# Altium schematic sheet BSPDInputs.SchDoc
size A4
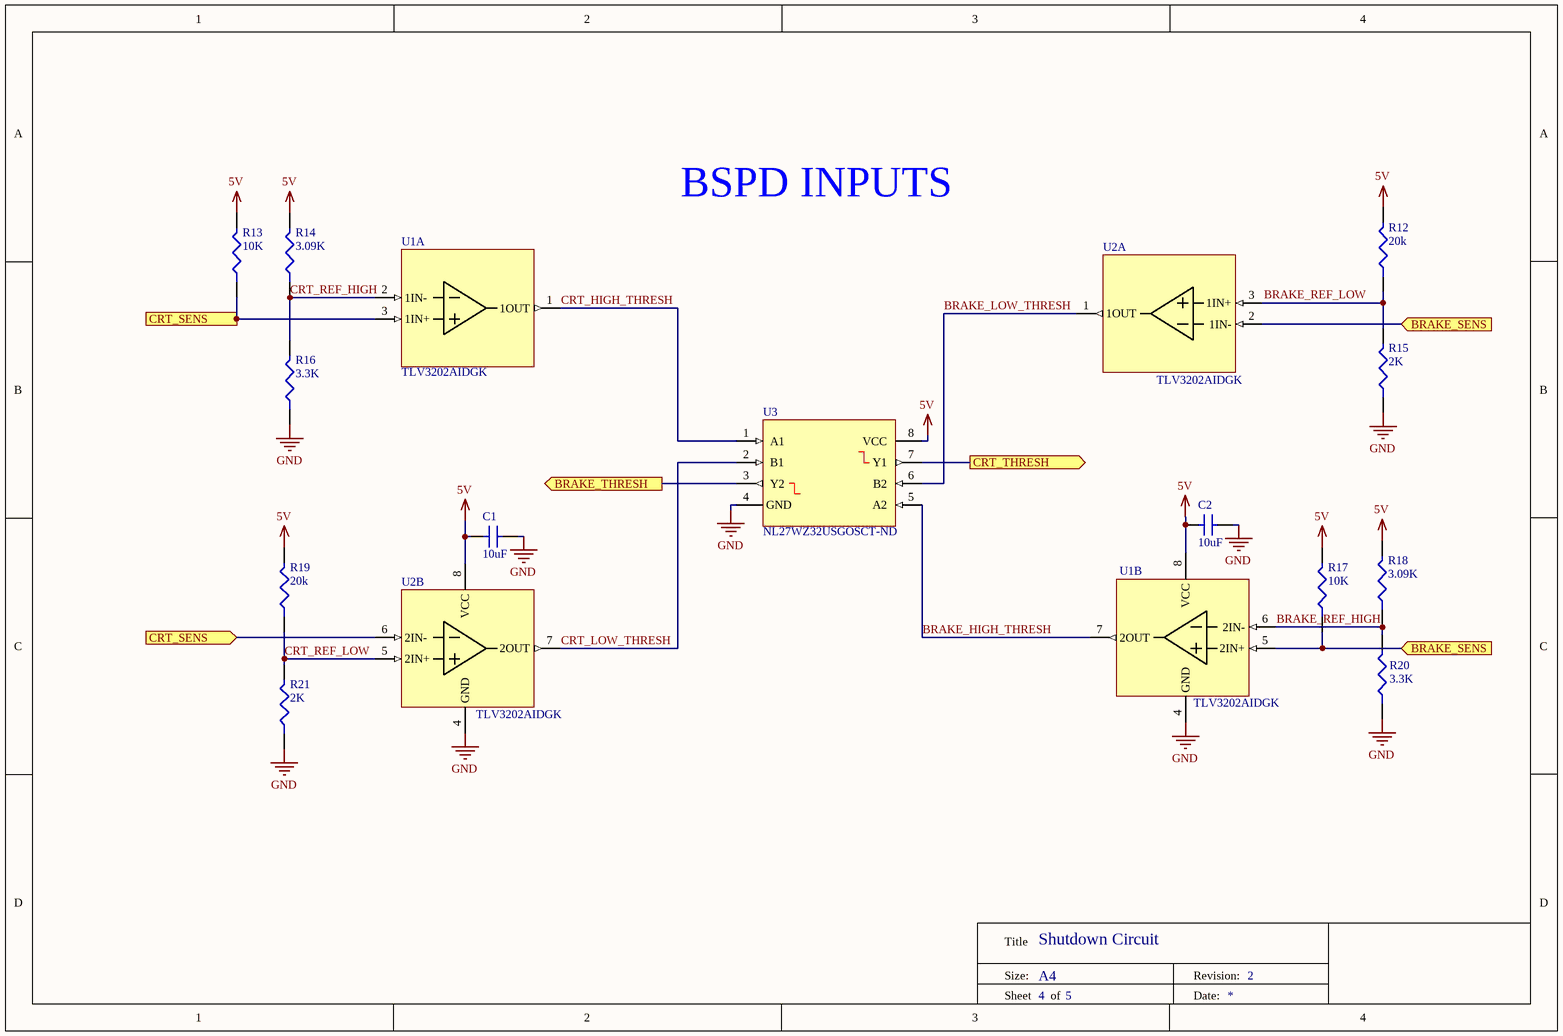
[diagram p0: BSPDInputs.SchDoc]

## Parts
C1  10uF  [C0805]
C2  10uF  [C0805]
R12  20k  [RESC1608X06N]
R13  10K  [R0805]
R14  3.09K  [ERJPB3]
R15  2K  [R0805]
R16  3.3K  [ERJPB3]
R17  10K  [R0805]
R18  3.09K  [ERJPB3]
R19  20k  [RESC1608X06N]
R20  3.3K  [ERJPB3]
R21  2K  [R0805]
U1  TLV3202AIDGK  [TLV3202AIDGK]  (parts A,B of 2)
U2  TLV3202AIDGK  [TLV3202AIDGK]  (parts A,B of 2)
U3  NL27WZ32USGOSCT-ND  [TSSOP50P310X90-8N]

## Ports
BRAKE_SENS (in), BRAKE_THRESH (out), CRT_SENS (in), CRT_THRESH (out)

## Nets
5V: C1.2 C2.2 R12.2 R13.2 R14.2 R17.2 R18.2 R19.2 U1.8(VCC) U2.8(VCC) U3.8(VCC)
GND: C1.1 C2.1 R15.1 R16.1 R20.1 R21.1 U1.4(GND) U2.4(GND) U3.4(GND)
BRAKE_HIGH_THRESH: U1.7(2OUT) U3.5(A2)
BRAKE_LOW_THRESH: U2.1(1OUT) U3.6(B2)
BRAKE_REF_HIGH: R18.1 R20.2 U1.6(2IN-)
BRAKE_REF_LOW: R12.1 R15.2 U2.3(1IN+)
BRAKE_SENS: R17.1 U1.5(2IN+) U2.2(1IN-) ; port BRAKE_SENS
BRAKE_THRESH: U3.3(Y2) ; port BRAKE_THRESH
CRT_HIGH_THRESH: U1.1(1OUT) U3.1(A1)
CRT_LOW_THRESH: U2.7(2OUT) U3.2(B1)
CRT_REF_HIGH: R14.1 R16.2 U1.2(1IN-)
CRT_REF_LOW: R19.1 R21.2 U2.5(2IN+)
CRT_SENS: R13.1 U1.3(1IN+) U2.6(2IN-) ; port CRT_SENS
CRT_THRESH: U3.7(Y1) ; port CRT_THRESH

## Notes on the sheet
- BSPD INPUTS
- Shutdown Circuit
- 2
- 4
- 5
- Title
- Size:
- A4
- Revision:
- Sheet
- of
- Date:

## Library data of the parts
C1 C2 = CL21A106KPFNNNG: Cap Ceramic 10uF 10V X5R 10% SMD 0805 85C Embossed T/R; Manufacturer: Samsung; Supplier 1: Digi-Key; Manufacturer Part Number: CL21A106KPFNNNG; Stock 1: 0; Pricing 1: 1=0.15, 10=0.104, 100=0.0489, 500=0.03428, 1000=0.02837 (USD); Mount: Surface Mount; Case/Package: 0805; Case Code (Metric): 2012; Case Code (Imperial): 0805; Min Operating Temperature: -55°C; Max Operating Temperature: 85°C; Capacitance: 10uF; Tolerance: 10%; Dielectric: X5R; Voltage: 10V; Voltage Rating: 10V; Packaging: Tape and Reel; Package Quantity: 3000; Termination: Wraparound; Length: 2mm; Height: 1.25mm; Depth: 1.25mm; Width: 0.049inch; Thickness: 0.053inch; Radiation Hardening: No; Lead Free: Lead Free; ComponentLink1URL: http://www1.futureelectronics.com/doc/SAMSUNG/CL21A106KPFNNNG.pdf?src-supplier=Future+Electronics; ComponentLink1Description: http://www1.futureelectronics.com/doc/SAMSUNG/CL21A106KPFNNNG.pdf?src-supplier=Future+Electronics; ComponentLink2URL: https://www.verical.com/server-webapp/html/getDatasheet?partID=640497&src-supplier=Verical; ComponentLink2Description: https://www.verical.com/server-webapp/html/getDatasheet?partID=640497&src-supplier=Verical; Supplier Part Number 1: 1276-6456-1-ND
R12 R19 = RC0603FR-0722KL: YAGEO - RC0603FR-0722KL - SMD Chip Resistor, 0603 [1608 Metric], 22 kohm, RC Series, 75 V, Thick Film, 100 mW; Temperature Coefficient: 100ppm/°C; Tolerance: 1%; Power Rating: 100mW; Resistance: 22kR; Voltage Rating (DC): 50V; Supplier 1: Digi-Key; Manufacturer: Yageo; Manufacturer Part Number: RC0603FR-0722KL; Stock 1: 4730667; Pricing 1: 1=0.10000, 10=0.02300, 100=0.00940, 1000=0.00421, 2500=0.00366 (USD); RoHS: Yes; Case/Package: 0603; Number of Pins: 2; Case Code (Imperial): 0603; Case Code (Metric): 1608; Min Operating Temperature: -55°C; Max Operating Temperature: 155°C; Packaging: Tape and Reel; Features: Moisture Resistant; Termination: SMD/SMT; Composition: Thick Film; Number of Terminations: 2; Max Power Dissipation: 100mW; Voltage Rating: 50V; Package Quantity: 1; Military Standard: Not; Length: 1.6mm; Height: 0.022inch; Depth: 0.8mm; Width: 0.031inch; Lead Free: Lead Free; REACH SVHC: No SVHC; ComponentLink1URL: https://datasheet.ciiva.com/2454/pyu-r-int-thick-7-2454424.pdf?src-supplier=Digi-Key; ComponentLink1Description: https://datasheet.ciiva.com/2454/pyu-r-int-thick-7-2454424.pdf?src-supplier=Digi-Key; ComponentLink2URL: https://datasheet.ciiva.com/2454/pyu-r-int-thick-7-2454425.pdf?src-supplier=Digi-Key; ComponentLink2Description: https://datasheet.ciiva.com/2454/pyu-r-int-thick-7-2454425.pdf?src-supplier=Digi-Key; ComponentLink3URL: https://datasheet.ciiva.com/15189/getdatasheetpartid-413247-15189661.pdf?src-supplier=Verical; ComponentLink3Description: https://datasheet.ciiva.com/15189/getdatasheetpartid-413247-15189661.pdf?src-supplier=Verical; ComponentLink4URL: https://datasheet.ciiva.com/7746/1686128-7746302.pdf?src-supplier=Element14; ComponentLink4Description: https://datasheet.ciiva.com/7746/1686128-7746302.pdf?src-supplier=Element14; ComponentLink5URL: https://datasheet.ciiva.com/46412/443971-46412846.pdf?src-supplier=Element14; ComponentLink5Description: https://datasheet.ciiva.com/46412/443971-46412846.pdf?src-supplier=Element14; ComponentLink6URL: https://datasheet.ciiva.com/7746/443971-7746303.pdf?src-supplier=Element14; ComponentLink6Description: https://datasheet.ciiva.com/7746/443971-7746303.pdf?src-supplier=Element14; ComponentLink7URL: https://datasheet.ciiva.com/2454/pyu-r-int-thick-7-2454423.pdf?src-supplier=Digi-Key; ComponentLink7Description: https://datasheet.ciiva.com/2454/pyu-r-int-thick-7-2454423.pdf?src-supplier=Digi-Key; Supplier Part Number 1: 311-22.0KHRCT-ND
R13 R17 = ERA6AEB103V: RES SMD 10K OHM 0.1% 1/8W 0805; Manufacturer: Panasonic; Voltage Rating: 100V; Resistance: 10kR; Power Rating: 125mW; Temperature Coefficient: 25ppm/°C; Supplier 1: Digi-Key; Manufacturer Part Number: ERA6AEB103V; Stock 1: 677238; Pricing 1: 1=0.36, 10=0.302, 100=0.1182, 1000=0.04948, 2500=0.04536 (USD); Mount: Surface Mount; Case/Package: 0805; Number of Pins: 2; Case Code (Metric): 2012; Case Code (Imperial): 0805; Contact Plating: Tin; Min Operating Temperature: -55°C; Max Operating Temperature: 155°C; Packaging: Tape and Reel; Tolerance: 0.1%; Package Quantity: 5000; Composition: Metal Film,Thin Film; Number of Terminations: 2; Termination: SMD/SMT; Military Standard: Not; Max Power Dissipation: 125mW; Working Voltage: 100V; Voltage Rating (DC): 100V; Length: 2mm; Height: 0.5mm; Width: 1.25mm; Depth: 1.25mm; Radiation Hardening: No; REACH SVHC: No SVHC; Lead Free: Lead Free; ComponentLink1URL: http://uk.rs-online.com/webdocs/0bee/0900766b80beefcc.pdf?src-supplier=RSComponents; ComponentLink1Description: http://uk.rs-online.com/webdocs/0bee/0900766b80beefcc.pdf?src-supplier=RSComponents; ComponentLink2URL: http://www.farnell.com/datasheets/2052875.pdf?src-supplier=Farnell; ComponentLink2Description: http://www.farnell.com/datasheets/2052875.pdf?src-supplier=Farnell; ComponentLink3URL: http://www.farnell.com/datasheets/485442.pdf?src-supplier=Element14; ComponentLink3Description: http://www.farnell.com/datasheets/485442.pdf?src-supplier=Element14; ComponentLink4URL: http://www.mouser.com/ds/2/315/AOA0000CE26-197354.pdf?src-supplier=Mouser; ComponentLink4Description: http://www.mouser.com/ds/2/315/AOA0000CE26-197354.pdf?src-supplier=Mouser; ComponentLink5URL: https://www.distrelec.biz/Web/Downloads/_t/ds/ERA_eng_tds.pdf?mime=application%2Fpdf&src-supplier=Distrelec; ComponentLink5Description: https://www.distrelec.biz/Web/Downloads/_t/ds/ERA_eng_tds.pdf?mime=application%2Fpdf&src-supplier=Distrelec; ComponentLink6URL: http://industrial.panasonic.com/www-data/pdf/AOA0000/AOA0000CE26.pdf?src-supplier=Avnet; ComponentLink6Description: http://industrial.panasonic.com/www-data/pdf/AOA0000/AOA0000CE26.pdf?src-supplier=Avnet; ComponentLink7URL: https://industrial.panasonic.com/cdbs/www-data/pdf/RDM0000/AOA0000C307.pdf?src-supplier=Future+Electronics; ComponentLink7Description: https://industrial.panasonic.com/cdbs/www-data/pdf/RDM0000/AOA0000C307.pdf?src-supplier=Future+Electronics; ComponentLink8URL: http://www.alliedelec.com/m/d/b6b0537e86f421aa7f5975bb1d8f429a.pdf?src-supplier=Allied+Electronics; ComponentLink8Description: http://www.alliedelec.com/m/d/b6b0537e86f421aa7f5975bb1d8f429a.pdf?src-supplier=Allied+Electronics; ComponentLink9URL: http://www.farnell.com/datasheets/2059650.pdf?src-supplier=Element14; ComponentLink9Description: http://www.farnell.com/datasheets/2059650.pdf?src-supplier=Element14; ComponentLink10URL: http://www.farnell.com/datasheets/485442.pdf?src-supplier=Farnell; ComponentLink10Description: http://www.farnell.com/datasheets/485442.pdf?src-supplier=Farnell; ComponentLink11URL: http://www.produktinfo.conrad.com/datenblaetter/450000-474999/453339-da-01-en-WIDERSTAND_0805_ERA.pdf?src-supplier=Conrad; ComponentLink11Description: http://www.produktinfo.conrad.com/datenblaetter/450000-474999/453339-da-01-en-WIDERSTAND_0805_ERA.pdf?src-supplier=Conrad; Supplier Part Number 1: P10KDACT-ND
R14 R18 = ERJ-PB3B3091V: RES SMD 3.09K OHM 0.1% 1/5W 0603; Manufacturer: Panasonic; Resistance: 3.09kR; Max Power Dissipation: 200mW; Temperature Coefficient: 50ppm/°C; Supplier 1: Digi-Key; Manufacturer Part Number: ERJ-PB3B3091V; Stock 1: 4580; Pricing 1: 1=0.25000, 10=0.21100, 25=0.15320, 50=0.11100, 100=0.08230, 250=0.06316, 500=0.04976, 1000=0.03445 (USD); RoHS: Yes; Case/Package: 0603; Case Code (Metric): 1608; Case Code (Imperial): 0603; Min Operating Temperature: -55°C; Max Operating Temperature: 155°C; Packaging: Tape and Reel; Composition: Thick Film; Number of Terminations: 2; Tolerance: 0.1%; Features: Automotive AEC-Q200; Length: 0.063inch; Width: 0.032inch; Height - Seated (Max): 0.022inch; ComponentLink1URL: https://industrial.panasonic.com/sa/system/files/data/download/catalog/id_fixed-resistors_e_2.pdf?src-supplier=Digi-Key; ComponentLink1Description: https://industrial.panasonic.com/sa/system/files/data/download/catalog/id_fixed-resistors_e_2.pdf?src-supplier=Digi-Key; Supplier Part Number 1: P20026CT-ND
R15 R21 = ERA6AEB202V: RES SMD 2K OHM 0.1% 1/8W 0805; Manufacturer: Panasonic; Resistance: 2kR; Power Rating: 125mW; Voltage Rating: 100V; Temperature Coefficient: 25ppm/°C; Supplier 1: Digi-Key; Manufacturer Part Number: ERA6AEB202V; Stock 1: 110386; Pricing 1: 1=0.36, 10=0.302, 100=0.1182, 1000=0.04948, 2500=0.04536 (USD); Mount: Surface Mount; Case/Package: 0805; Number of Pins: 2; Case Code (Metric): 2012; Case Code (Imperial): 0805; Contact Plating: Tin; Min Operating Temperature: -55°C; Max Operating Temperature: 155°C; Tolerance: 0.1%; Packaging: Tape and Reel; Package Quantity: 1; Composition: Thin Film; Termination: SMD/SMT; Number of Terminations: 2; Military Standard: Not; Max Power Dissipation: 125mW; Voltage Rating (DC): 100V; Features: Automotive AEC-Q200; Length: 2mm; Height: 0.5mm; Width: 1.25mm; Depth: 1.25mm; Radiation Hardening: No; REACH SVHC: No SVHC; Lead Free: Lead Free; ComponentLink1URL: http://industrial.panasonic.com/www-data/pdf/AOA0000/AOA0000CE26.pdf?src-supplier=Future+Electronics; ComponentLink1Description: http://industrial.panasonic.com/www-data/pdf/AOA0000/AOA0000CE26.pdf?src-supplier=Future+Electronics; ComponentLink2URL: http://industrial.panasonic.com/www-data/pdf/AOA0000/AOA0000CE26.pdf?src-supplier=Avnet+Europe; ComponentLink2Description: http://industrial.panasonic.com/www-data/pdf/AOA0000/AOA0000CE26.pdf?src-supplier=Avnet+Europe; ComponentLink3URL: https://www.alliedelec.com/m/d/b6b0537e86f421aa7f5975bb1d8f429a.pdf?src-supplier=Allied+Electronics; ComponentLink3Description: https://www.alliedelec.com/m/d/b6b0537e86f421aa7f5975bb1d8f429a.pdf?src-supplier=Allied+Electronics; ComponentLink4URL: http://www.farnell.com/datasheets/485442.pdf?src-supplier=Element14; ComponentLink4Description: http://www.farnell.com/datasheets/485442.pdf?src-supplier=Element14; ComponentLink5URL: http://www.farnell.com/datasheets/1776116.pdf?src-supplier=Element14; ComponentLink5Description: http://www.farnell.com/datasheets/1776116.pdf?src-supplier=Element14; ComponentLink6URL: https://www.distrelec.biz/Web/Downloads/_t/ds/ERA_eng_tds.pdf?mime=application%2Fpdf&src-supplier=Distrelec; ComponentLink6Description: https://www.distrelec.biz/Web/Downloads/_t/ds/ERA_eng_tds.pdf?mime=application%2Fpdf&src-supplier=Distrelec; ComponentLink7URL: http://www.farnell.com/datasheets/2052875.pdf?src-supplier=Farnell; ComponentLink7Description: http://www.farnell.com/datasheets/2052875.pdf?src-supplier=Farnell; ComponentLink8URL: http://www.farnell.com/datasheets/2059650.pdf?src-supplier=Farnell; ComponentLink8Description: http://www.farnell.com/datasheets/2059650.pdf?src-supplier=Farnell; ComponentLink9URL: http://industrial.panasonic.com/www-data/pdf/AOA0000/AOA0000CE26.pdf?src-supplier=Avnet; ComponentLink9Description: http://industrial.panasonic.com/www-data/pdf/AOA0000/AOA0000CE26.pdf?src-supplier=Avnet; ComponentLink10URL: https://produktinfo.conrad.com/datenblaetter/450000-474999/453123-da-01-en-WIDERSTAND_0805_ERA.pdf?src-supplier=Conrad; ComponentLink10Description: https://produktinfo.conrad.com/datenblaetter/450000-474999/453123-da-01-en-WIDERSTAND_0805_ERA.pdf?src-supplier=Conrad; Supplier Part Number 1: P2.0KDACT-ND
R16 R20 = ERJ-PB3B3301V: RES SMD 3.3K OHM 0.1% 1/5W 0603; Manufacturer: Panasonic; Resistance: 3.3kR; Max Power Dissipation: 200mW; Temperature Coefficient: 50ppm/°C; Supplier 1: Digi-Key; Manufacturer Part Number: ERJ-PB3B3301V; Stock 1: 3105; Pricing 1: 1=0.25000, 10=0.21100, 25=0.15320, 50=0.11100, 100=0.08230, 250=0.06316, 500=0.04976, 1000=0.03445 (USD); RoHS: Yes; Case/Package: 0603; Case Code (Metric): 1608; Case Code (Imperial): 0603; Min Operating Temperature: -55°C; Max Operating Temperature: 155°C; Packaging: Tape and Reel; Composition: Thick Film; Number of Terminations: 2; Tolerance: 0.1%; Features: Automotive AEC-Q200; Length: 0.063inch; Width: 0.032inch; Height - Seated (Max): 0.022inch; ComponentLink1URL: https://industrial.panasonic.com/cdbs/www-data/pdf/RDM0000/DMM0000COL5.pdf?src-supplier=Digi-Key; ComponentLink1Description: https://industrial.panasonic.com/cdbs/www-data/pdf/RDM0000/DMM0000COL5.pdf?src-supplier=Digi-Key; Supplier Part Number 1: P20029CT-ND
U1 U2 = TLV3202AIDGK: IC COMPAR PWR RRI DL PP 8VSSOP; Manufacturer: Texas Instruments; Min Supply Voltage: 2.7V; Max Supply Voltage: 5.5V; Number of Elements: 2; Nominal Supply Current: 50uA; Max Supply Current: 40uA; Input Bias Current: 50pA; Input Offset Voltage (Vos): 5mV; Response Time: 0.047us; Propagation Delay: 50ns; Common Mode Rejection Ratio: 70dB; Hysteresis: 1.2mV; Power Supply Rejection Ratio (PSRR): 85dB; ComponentLink1Description: digikey.ca; ComponentLink1URL: https://www.digikey.ca/product-detail/en/texas-instruments/TLV3202AIDGK/296-34992-ND/3588984; Supplier 1: Digi-Key; Manufacturer Part Number: TLV3202AIDGK; Stock 1: 14534; Pricing 1: 1=1.77, 80=1.5, 160=1.278, 560=1.05, 1040=0.87 (USD); Mount: Surface Mount; Case/Package: VSSOP; Number of Pins: 8; Min Operating Temperature: -40°C; Max Operating Temperature: 125°C; Packaging: Rail/Tube; Package Quantity: 80; Number of Channels: 2; Max Input Current: 50pA; Quiescent Current: 50uA; Type: General Purpose; Length: 3.1mm; Height: 0.95mm; Width: 3.1mm; Radiation Hardening: No; Lead Free: Lead Free; REACH SVHC: No SVHC; ComponentLink2URL: https://datasheet.ciiva.com/12288/tlv3202-193866-12288098.pdf; ComponentLink2Description: https://datasheet.ciiva.com/12288/tlv3202-193866-12288098.pdf; ComponentLink3URL: https://datasheet.ciiva.com/23702/1645741-23702136.pdf; ComponentLink3Description: https://datasheet.ciiva.com/23702/1645741-23702136.pdf; ComponentLink4URL: https://datasheet.ciiva.com/8066/1645741-8066013.pdf; ComponentLink4Description: https://datasheet.ciiva.com/8066/1645741-8066013.pdf; Supplier Part Number 1: 296-34992-ND; Supplier 2: Digi-Key
U3 = OR GATE: IC GATE OR 2CH 2-INP US8; Manufacturer: ON Semiconductor; Number of Gates: 2; Propagation Delay: 6.2ns; Max Supply Voltage: 5.5V; Min Supply Voltage: 1.65V; Number of Outputs: 1; Operating Supply Voltage: 3.25V; Schmitt Trigger Input: No; Low Level Output Current: 32mA; Quiescent Current: 1uA; High Level Output Current: -32mA; Turn-On Delay Time: 5.2ns; Output Current: 50mA; Supplier 1: Digi-Key; Manufacturer Part Number: NL27WZ32USG; Stock 1: 5684; Pricing 1: 1=0.39000, 10=0.31700, 25=0.29000, 100=0.21570, 250=0.19548, 500=0.16176, 1000=0.12132 (USD); RoHS: Yes; Mount: Surface Mount; Number of Pins: 8; Contact Plating: Tin,Matte; Min Operating Temperature: -40°C; Max Operating Temperature: 85°C; Packaging: Tape and Reel; Package Quantity: 1; Number of Inputs: 2; Logic Function: OR; Number of Circuits: 2; Number of Elements: 2; Length: 2.4mm; Height: 0.8mm; Width: 2.1mm; Radiation Hardening: No; REACH SVHC: No SVHC; Lead Free: Lead Free; Halogen Free: Halogen Free; ComponentLink1URL: https://datasheet.ciiva.com/8277/nl27wz32-d-8277742.pdf?src-supplier=Avnet; ComponentLink1Description: https://datasheet.ciiva.com/8277/nl27wz32-d-8277742.pdf?src-supplier=Avnet; ComponentLink2URL: https://datasheet.ciiva.com/4820/nl27wz32-d-114831-4820790.pdf?src-supplier=Mouser; ComponentLink2Description: https://datasheet.ciiva.com/4820/nl27wz32-d-114831-4820790.pdf?src-supplier=Mouser; ComponentLink3URL: https://datasheet.ciiva.com/15090/getdatasheetpartid-69948-15090488.pdf?src-supplier=Verical; ComponentLink3Description: https://datasheet.ciiva.com/15090/getdatasheetpartid-69948-15090488.pdf?src-supplier=Verical; ComponentLink4URL: https://datasheet.ciiva.com/26864/nl27wz32usg-26864780.pdf?src-supplier=IIIC; ComponentLink4Description: https://datasheet.ciiva.com/26864/nl27wz32usg-26864780.pdf?src-supplier=IIIC; ComponentLink5URL: https://datasheet.ciiva.com/1872/nl27wz32-d-1872823.pdf?src-supplier=Digi-Key; ComponentLink5Description: https://datasheet.ciiva.com/1872/nl27wz32-d-1872823.pdf?src-supplier=Digi-Key; ComponentLink6URL: https://datasheet.ciiva.com/26049/nl27wz32-d-26049116.pdf?src-supplier=Avnet+Europe; ComponentLink6Description: https://datasheet.ciiva.com/26049/nl27wz32-d-26049116.pdf?src-supplier=Avnet+Europe; ComponentLink7URL: https://datasheet.ciiva.com/1872/nl27wz32-d-1872824.pdf?src-supplier=Digi-Key; ComponentLink7Description: https://datasheet.ciiva.com/1872/nl27wz32-d-1872824.pdf?src-supplier=Digi-Key; ComponentLink8URL: https://datasheet.ciiva.com/1872/nl27wz32-d-1872825.pdf?src-supplier=Digi-Key; ComponentLink8Description: https://datasheet.ciiva.com/1872/nl27wz32-d-1872825.pdf?src-supplier=Digi-Key; ComponentLink9URL: https://datasheet.ciiva.com/16471/nl27wz32-d-16471564.pdf?src-supplier=Future+Electronics; ComponentLink9Description: https://datasheet.ciiva.com/16471/nl27wz32-d-16471564.pdf?src-supplier=Future+Electronics; Supplier Part Number 1: NL27WZ32USGOSCT-ND